# EAGLE design max232 (EAGLE 5.10)
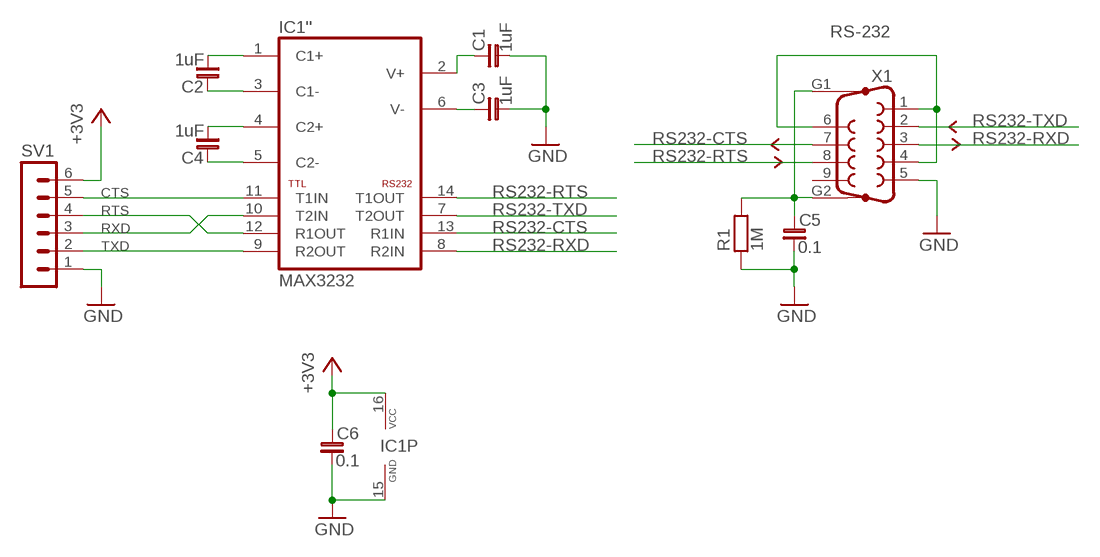
[diagram p0: schematic, sheet 1]

## Parts
C1  1uF  C_0805  [C0805]
C2  1uF  C_0805  [C0805]
C3  1uF  C_0805  [C0805]
C4  1uF  C_0805  [C0805]
C5  0.1  C_1206  [C1206]
C6  0.1  C_0805  [C0805]
IC1  MAX3232  MAX232-SO  [SO16]
R1  1M  R_0805  [R0805]
SV1  MA06-1  [MA06-1]
X1  F09HP-7.2  [F09HP-7.2]

## Nets
+3V3: C6.1 IC1.16(P:VCC) SV1.6
CTS: IC1.11('':T1IN) SV1.5
GND: C1.2 C3.2 C5.2 C6.2 IC1.15(P:GND) R1.1 SV1.1 X1.5
N$4: X1.1 X1.4 X1.6
N$5: C5.1 R1.2 X1.G1 X1.G2
N$15: C4.2 IC1.4('':C2+)
N$16: C4.1 IC1.5('':C2-)
N$17: C2.1 IC1.3('':C1-)
N$19: C2.2 IC1.1('':C1+)
N$24: C1.1 IC1.2('':V+)
N$25: C3.1 IC1.6('':V-)
RS232-CTS: IC1.13('':R1IN) X1.7
RS232-RTS: IC1.14('':T1OUT) X1.8
RS232-RXD: IC1.8('':R2IN) X1.3
RS232-TXD: IC1.7('':T2OUT) X1.2
RTS: IC1.12('':R1OUT) SV1.4
RXD: IC1.10('':T2IN) SV1.3
TXD: IC1.9('':R2OUT) SV1.2
Unconnected: X1.9

## Notes on the sheet
- RS-232

## Library data of the parts
C1-C6 = rc-master-smd:C_: NON-POLARIZED CAP
IC1 = rs232-rs485:MAX232: RS232 TRANSEIVER
R1 = rc-master-smd:R_: RESISTOR
SV1 = con-lstb:MA06-1: PIN HEADER
X1 = sub-d:F09HP: SUB-D

## Board
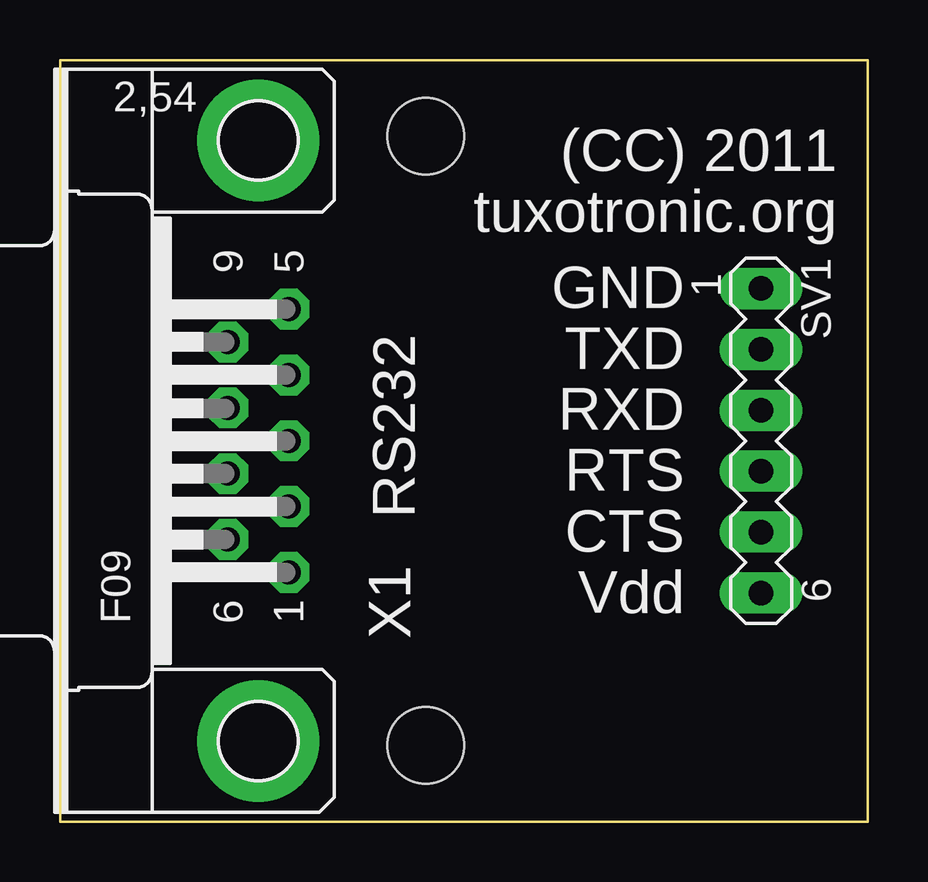
[diagram p1: board, top side]
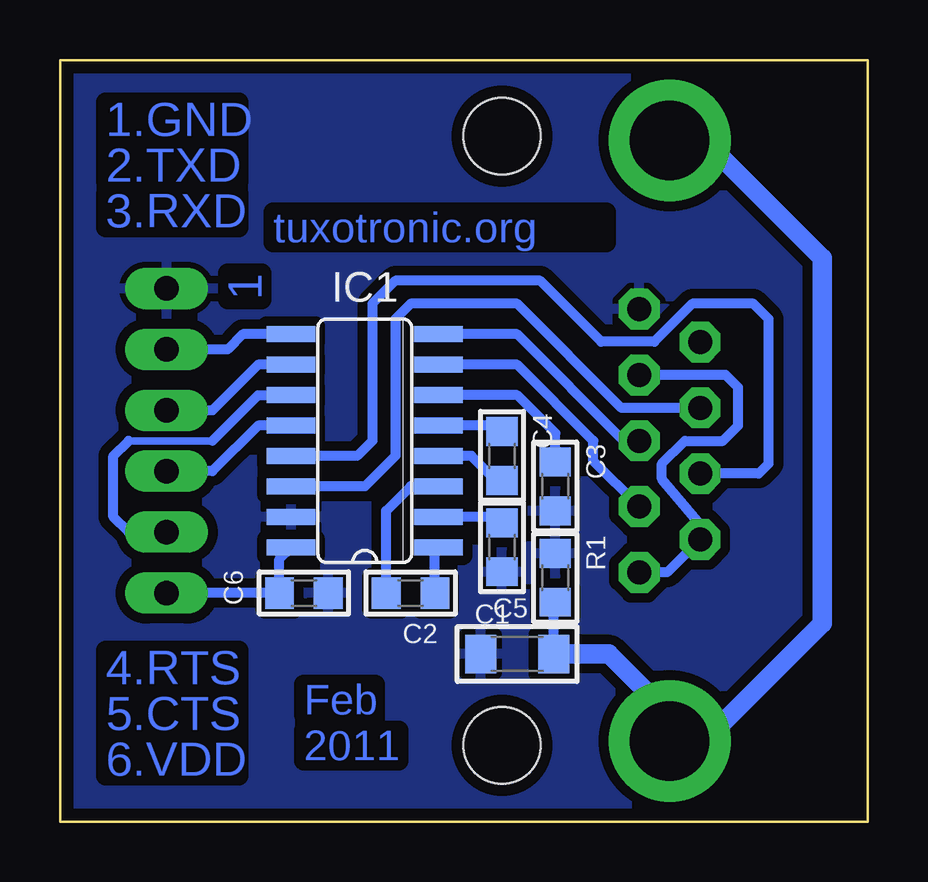
[diagram p2: board, bottom side, seen from below]

Size 33.66 x 31.75 mm. Coordinates in mm from the lower left corner, seen from the top.
Outline: 0,0 33.66,0 33.66,31.75 0,31.75 0,0
Copper layers (1*16): Top 0.035mm / dielectric 1.5mm / Bottom 0.035mm
Design rules "default *": minimum track width 10mil, minimum drill 24mil, track to track 8mil, track to pad 8mil, pad to pad 8mil, via to via 8mil, smd to smd 8mil, copper to edge 0.5mm, drill to drill 8mil, minimum pad ring 10mil, minimum via ring 8mil, stop-mask expansion 4mil, vias tented up to drill 0mil, thermal gap 10mil
Holes 3.2 mm at 15.24,28.57 15.24,3.17

### Footprints (pad centres in the part's own frame; a part is rotated, then mirrored left to right if it is on the bottom)
C0805 = smd 1.2 x 1.3: 1 -1.016,0; 2 1.016,0
C1206 = smd 1.3 x 1.6: 1 -1.524,0; 2 1.524,0
SO16 = smd 0.66 x 2.032: 1 -4.445,-3.073; 2 -3.175,-3.073; 3 -1.905,-3.073; 4 -0.635,-3.073; 5 0.635,-3.073; 6 1.905,-3.073; 7 3.175,-3.073; 8 4.445,-3.073; 9 4.445,3.073; 10 3.175,3.073; 11 1.905,3.073; 12 0.635,3.073; 13 -0.635,3.073; 14 -1.905,3.073; 15 -3.175,3.073; 16 -4.445,3.073
R0805 = smd 1.2 x 1.3: 1 -1.016,0; 2 1.016,0
MA06-1 = drill 1.016 long: 1 -6.35,0; 2 -3.81,0; 3 -1.27,0; 4 1.27,0; 5 3.81,0; 6 6.35,0
F09HP-7.2 = drill 1 octagon: 1 -5.486,-2.54; 2 -2.743,-2.54; 3 0,-2.54; 4 2.743,-2.54; 5 5.486,-2.54; 6 -4.115,0; 7 -1.372,0; 8 1.372,0; 9 4.115,0 | drill 3.3 pad 5.08 round: G1 -12.522,-1.27; G2 12.522,-1.27

### Placement (x,y rotation side)
C1  15.24,11.43 270 bottom
C2  19.05,9.53 0 bottom
C3  13.02,13.97 270 bottom
C4  15.24,15.24 270 bottom
C5  14.61,6.99 180 bottom
C6  23.5,9.53 0 bottom
IC1  20.95,15.88 90 bottom
R1  13.02,10.16 270 bottom
SV1  29.21,15.88 270 top
X1  6.99,15.88 90 top

### Tracks (layer width: path | path; a pad name or v marks a point on that pad's centre or on a via)
+3V3
  Bottom 0.406: SV1.6 C6.1 24.51,10.95 IC1.16
CTS
  Bottom 0.305: 30.8,15.88 27.3,15.88
  Bottom 0.406: IC1.11 25.4,17.78 27.3,15.88 | 30.8,15.88 31.43,15.24 31.43,12.7 30.8,12.06 SV1.5
GND
  pour Bottom (isolate 0.406): -0.64,33.02 34.92,33.02 34.92,-0.64 -0.64,-0.64
N$4
  Bottom 0.406: X1.4 5.92,18.62 5.4,18.1 5.4,16.51 6.03,15.88 7.62,15.88 8.57,14.92 8.57,14.29 6.99,12.38 X1.6 8.36,10.39 X1.1
N$5
  Bottom 0.406: C5.1 13.08,9.08 R1.2
  Bottom 0.813: X1.G2 6.81,28.4 1.91,23.5 1.91,8.26 6.81,3.35 X1.G1 8.26,4.45 10.79,6.99 C5.1
N$15
  Bottom 0.406: IC1.4 16.51,15.24 15.49,14.22 C4.2
N$16
  Bottom 0.406: IC1.5 15.49,16.51 C4.1
N$17
  Bottom 0.406: IC1.3 19.05,13.97 20.07,12.95 C2.1
N$19
  Bottom 0.406: C2.2 18.03,11.28 IC1.1
N$24
  Bottom 0.406: IC1.2 15.49,12.7 C1.1
N$25
  Bottom 0.406: IC1.6 14.61,17.78 13.02,16.19 C3.1
RS232-CTS
  Bottom 0.406: IC1.13 21.27,15.24 20.64,15.88 20.64,21.59 19.68,22.54 13.65,22.54 11.11,20 8.89,20 7.3,21.59 4.76,21.59 4.13,20.95 4.13,14.92 4.55,14.5 X1.7
RS232-RTS
  Bottom 0.406: IC1.14 20.95,13.97 19.68,15.24 19.68,20.95 19.05,21.59 14.61,21.59 10.26,17.25 X1.8
RS232-RXD
  Bottom 0.406: IC1.8 14.61,20.32 10.16,15.88 X1.3
RS232-TXD
  Bottom 0.406: IC1.7 14.61,19.05 11.43,15.88 11.43,15.04 X1.2
RTS
  Bottom 0.406: IC1.12 25.4,16.51 27.3,14.61 SV1.4
RXD
  Bottom 0.406: IC1.10 25.4,19.05 27.3,17.14 SV1.3
TXD
  Bottom 0.406: IC1.9 26.04,20.32 26.67,19.68 SV1.2

### Text on the board
Bottom: 1.GND | 2.TXD | 3.RXD | tuxotronic.org | 1 | 4.RTS | Feb | 5.CTS | 2011 | 6.VDD
tNames: (CC) 2011 | tuxotronic.org | GND | TXD | RS232 | RXD | RTS | CTS | Vdd